# EAGLE schematic mav_nus_breakout (EAGLE 7.7.0)
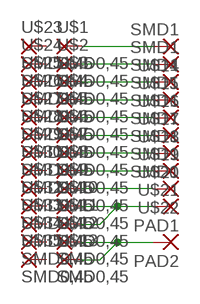
[diagram p0: schematic, sheet 1]

## Parts
PAD1  SMD2  [SMD1,27-2,54]
PAD2  SMD2  [SMD1,27-2,54]
U$1  SMD0,45  [SMD0,45-1,35]
U$2  SMD0,45  [SMD0,45-1,35]
U$3  SMD0,45  [SMD0,45-1,35]
U$4  SMD0,45  [SMD0,45-1,35]
U$5  SMD0,45  [SMD0,45-1,35]
U$6  SMD0,45  [SMD0,45-1,35]
U$7  SMD0,45  [SMD0,45-1,35]
U$8  SMD0,45  [SMD0,45-1,35]
U$9  SMD0,45  [SMD0,45-1,35]
U$10  SMD0,45  [SMD0,45-1,35]
U$11  SMD0,45  [SMD0,45-1,35]
U$12  SMD0,45  [SMD0,45-1,35]
U$13  SMD0,45  [SMD0,45-1,35]
U$14  SMD1  [SMD0,8-1,6]
U$15  SMD1  [SMD0,8-1,6]
U$16  SMD1  [SMD0,8-1,6]
U$17  SMD1  [SMD0,8-1,6]
U$18  SMD1  [SMD0,8-1,6]
U$19  SMD1  [SMD0,8-1,6]
U$20  SMD1  [SMD0,8-1,6]
U$21  SMD1  [SMD0,8-1,6]
U$22  SMD1  [SMD0,8-1,6]
U$23  SMD0,45  [SMD0,45-1,35]
U$24  SMD0,45  [SMD0,45-1,35]
U$25  SMD0,45  [SMD0,45-1,35]
U$26  SMD0,45  [SMD0,45-1,35]
U$27  SMD0,45  [SMD0,45-1,35]
U$28  SMD0,45  [SMD0,45-1,35]
U$29  SMD0,45  [SMD0,45-1,35]
U$30  SMD0,45  [SMD0,45-1,35]
U$31  SMD0,45  [SMD0,45-1,35]
U$32  SMD0,45  [SMD0,45-1,35]
U$33  SMD0,45  [SMD0,45-1,35]
U$34  SMD0,45  [SMD0,45-1,35]
U$35  SMD0,45  [SMD0,45-1,35]

## Nets
N$1: U$1.P$1(P) U$14.P$1(P)
N$2: U$2.P$1(P) U$15.P$1(P)
N$3: U$3.P$1(P) U$16.P$1(P)
N$4: U$4.P$1(P) U$17.P$1(P)
N$5: U$5.P$1(P) U$18.P$1(P)
N$6: U$6.P$1(P) U$19.P$1(P)
N$7: U$7.P$1(P) U$20.P$1(P)
N$8: U$8.P$1(P) U$21.P$1(P)
N$9: U$9.P$1(P) U$22.P$1(P)
N$10: PAD1.1(P) U$10.P$1(P) U$11.P$1(P)
N$11: PAD2.1(P) U$12.P$1(P) U$13.P$1(P)
Unconnected: U$23.P$1(P) U$24.P$1(P) U$25.P$1(P) U$26.P$1(P) U$27.P$1(P) U$28.P$1(P) U$29.P$1(P) U$30.P$1(P) U$31.P$1(P) U$32.P$1(P) U$33.P$1(P) U$34.P$1(P) U$35.P$1(P)

## Library data of the parts
PAD1 PAD2 = wirepad:SMD2: SMD PAD
U$1-U$13 U$23-U$35 = wirepad:SMD0,45
U$14-U$22 = wirepad:SMD1